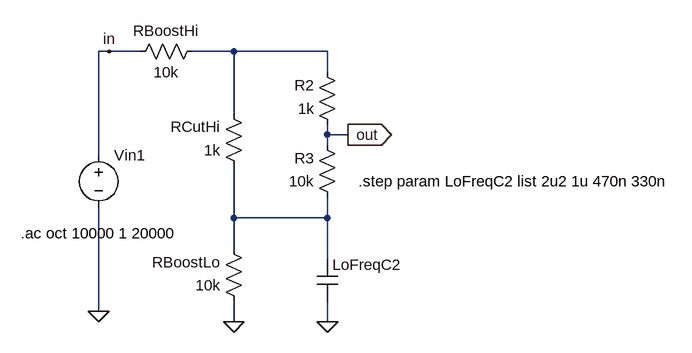
[diagram p0: schematic LoBoost.asc]
LoBoost.asc, the LTspice schematic file:
Version 4
SHEET 1 968 680
WIRE 64 0 48 0
WIRE 112 0 64 0
WIRE 256 0 192 0
WIRE 400 0 256 0
WIRE 400 32 400 0
WIRE 256 96 256 0
WIRE 400 128 400 112
WIRE 432 128 400 128
WIRE 400 144 400 128
WIRE 48 160 48 0
WIRE 256 256 256 176
WIRE 400 256 400 224
WIRE 400 256 256 256
WIRE 256 304 256 256
WIRE 400 320 400 256
WIRE 48 400 48 240
WIRE 256 416 256 384
WIRE 400 416 400 384
FLAG 48 400 0
FLAG 256 416 0
FLAG 400 416 0
FLAG 432 128 out
IOPIN 432 128 Out
FLAG 64 0 in
SYMBOL voltage 48 144 R0
WINDOW 3 24 96 Invisible 2
SYMATTR Value ""
SYMATTR Value2 AC 1
SYMATTR InstName Vin1
SYMBOL res 208 -16 R90
WINDOW 0 0 56 VBottom 2
WINDOW 3 32 56 VTop 2
SYMATTR InstName RBoostHi
SYMATTR Value 10k
SYMBOL res 272 192 R180
WINDOW 0 36 76 Left 2
WINDOW 3 36 40 Left 2
SYMATTR InstName RCutHi
SYMATTR Value 1k
SYMBOL res 416 128 R180
WINDOW 0 36 76 Left 2
WINDOW 3 36 40 Left 2
SYMATTR InstName R2
SYMATTR Value 1k
SYMBOL res 416 240 R180
WINDOW 0 36 76 Left 2
WINDOW 3 36 40 Left 2
SYMATTR InstName R3
SYMATTR Value 10k
SYMBOL res 272 400 R180
WINDOW 0 36 76 Left 2
WINDOW 3 36 40 Left 2
SYMATTR InstName RBoostLo
SYMATTR Value 10k
SYMBOL cap 384 320 R0
WINDOW 3 24 56 Invisible 2
SYMATTR Value {LoFreqC2}
SYMATTR InstName LoFreqC2
TEXT -72 280 Left 2 !.ac oct 10000 1 20000
TEXT 448 200 Left 2 !.step param LoFreqC2 list 2u2 1u 470n 330n

The netlist it stands for:
* LoBoost.asc
Vin1 in 0 AC 1
RBoostHi N001 in 10k
RCutHi N002 N001 1k
R2 out N001 1k
R3 N002 out 10k
RBoostLo 0 N002 10k
C§LoFreqC2 N002 0 {LoFreqC2}
.ac oct 10000 1 20000
.step param LoFreqC2 list 2u2 1u 470n 330n
.backanno
.end